# EAGLE design TTGO_shield_revH (EAGLE 9.1.2)
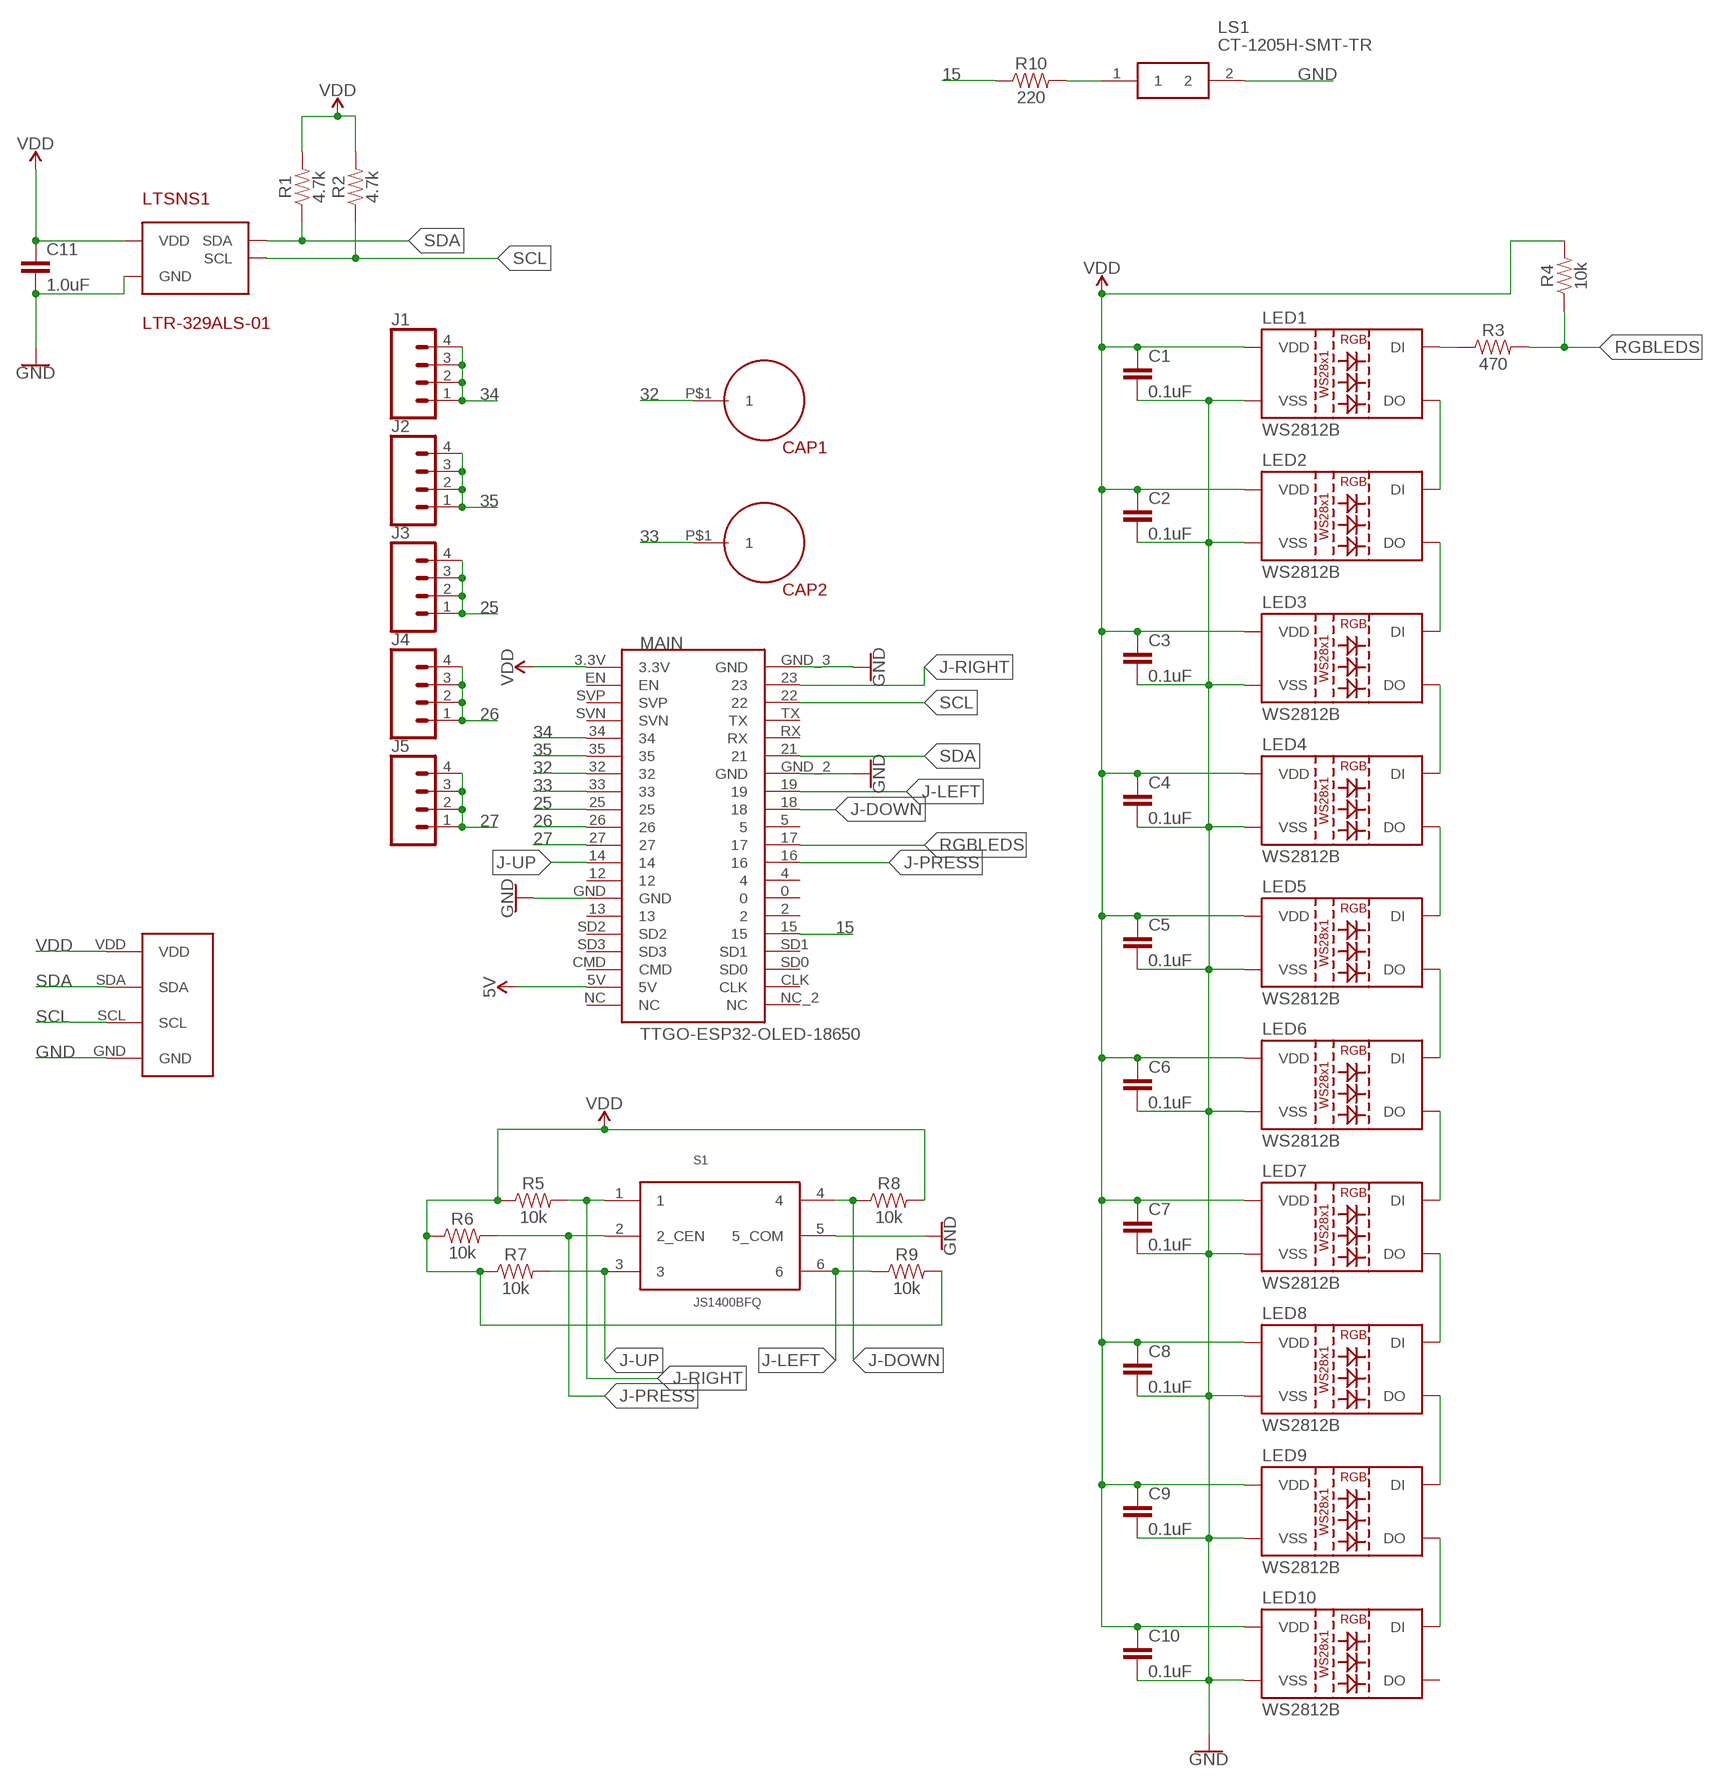
[diagram p0: schematic, sheet 1]

## Parts
C1  0.1uF  0.1UF-0603-25V-5%  [0603]
C2  0.1uF  0.1UF-0603-25V-5%  [0603]
C3  0.1uF  0.1UF-0603-25V-5%  [0603]
C4  0.1uF  0.1UF-0603-25V-5%  [0603]
C5  0.1uF  0.1UF-0603-25V-5%  [0603]
C6  0.1uF  0.1UF-0603-25V-5%  [0603]
C7  0.1uF  0.1UF-0603-25V-5%  [0603]
C8  0.1uF  0.1UF-0603-25V-5%  [0603]
C9  0.1uF  0.1UF-0603-25V-5%  [0603]
C10  0.1uF  0.1UF-0603-25V-5%  [0603]
C11  1.0uF  1.0UF-0805-25V-10%  [0805]
CAP1  CAPSENSE_BUTTON  [CAPSENSE_BUTTON]
CAP2  CAPSENSE_BUTTON  [CAPSENSE_BUTTON]
J1  CONN_04LONGPADS  [1X04_LONGPADS]
J2  CONN_04LONGPADS  [1X04_LONGPADS]
J3  CONN_04LONGPADS  [1X04_LONGPADS]
J4  CONN_04LONGPADS  [1X04_LONGPADS]
J5  CONN_04LONGPADS  [1X04_LONGPADS]
LED1  WS2812B  [WS2812B]
LED2  WS2812B  [WS2812B]
LED3  WS2812B  [WS2812B]
LED4  WS2812B  [WS2812B]
LED5  WS2812B  [WS2812B]
LED6  WS2812B  [WS2812B]
LED7  WS2812B  [WS2812B]
LED8  WS2812B  [WS2812B]
LED9  WS2812B  [WS2812B]
LED10  WS2812B  [WS2812B]
LS1  CT-1205H-SMT-TR  [CT1205HSMTTR]
LTSNS1  LTR-329ALS-01  [CHIPLED-4]
MAIN  TTGO-ESP32-OLED-18650  [TTGO-ESP32-OLED-18650]
R1  4.7k  4.7KOHM-0603-1/10W-1%  [0603]
R2  4.7k  4.7KOHM-0603-1/10W-1%  [0603]
R3  470  470OHM-0603-1/10W-1%  [0603]
R4  10k  10KOHM-0603-1/10W-1%  [0603]
R5  10k  10KOHM-0603-1/10W-1%  [0603]
R6  10k  10KOHM-0603-1/10W-1%  [0603]
R7  10k  10KOHM-0603-1/10W-1%  [0603]
R8  10k  10KOHM-0603-1/10W-1%  [0603]
R9  10k  10KOHM-0603-1/10W-1%  [0603]
R10  220  470OHM-0603-1/10W-1%  [0603]
S1  JS1400BFQ  [JS1400BFQ]
U$2  I2C-FEMALE-HEADER  [I2C-FEMALE-HEADER]

## Nets
5V: MAIN.5V
15: MAIN.15 R10.1
25: J3.1 J3.2 J3.3 J3.4 MAIN.25
26: J4.1 J4.2 J4.3 J4.4 MAIN.26
27: J5.1 J5.2 J5.3 J5.4 MAIN.27
32: CAP1.P$1 MAIN.32
33: CAP2.P$1 MAIN.33
34: J1.1 J1.2 J1.3 J1.4 MAIN.34
35: J2.1 J2.2 J2.3 J2.4 MAIN.35
GND [Rail]: C1.2 C2.2 C3.2 C4.2 C5.2 C6.2 C7.2 C8.2 C9.2 C10.2 C11.2 LED1.3(VSS) LED2.3(VSS) LED3.3(VSS) LED4.3(VSS) LED5.3(VSS) LED6.3(VSS) LED7.3(VSS) LED8.3(VSS) LED9.3(VSS) LED10.3(VSS) LS1.2 LTSNS1.2(GND) MAIN.GND MAIN.GND_2(GND) MAIN.GND_3(GND) S1.5(5_COM) U$2.GND
J-DOWN: MAIN.18 R8.1 S1.4
J-LEFT: MAIN.19 R9.1 S1.6
J-PRESS: MAIN.16 R6.2 S1.2(2_CEN)
J-RIGHT: MAIN.23 R5.2 S1.1
J-UP: MAIN.14 R7.2 S1.3
N$1: LED5.2(DO) LED6.4(DI)
N$2: LED6.2(DO) LED7.4(DI)
N$3: LED7.2(DO) LED8.4(DI)
N$4: LED8.2(DO) LED9.4(DI)
N$5: LED4.2(DO) LED5.4(DI)
N$6: LED9.2(DO) LED10.4(DI)
N$7: LS1.1 R10.2
N$9: LED1.2(DO) LED2.4(DI)
N$10: LED2.2(DO) LED3.4(DI)
N$11: LED3.2(DO) LED4.4(DI)
N$12: LED1.4(DI) R3.1
RGBLEDS: MAIN.17 R3.2 R4.1
SCL: LTSNS1.4(SCL) MAIN.22 R2.1 U$2.SCL
SDA: LTSNS1.3(SDA) MAIN.21 R1.1 U$2.SDA
VDD [Rail]: C1.1 C2.1 C3.1 C4.1 C5.1 C6.1 C7.1 C8.1 C9.1 C10.1 C11.1 LED1.1(VDD) LED2.1(VDD) LED3.1(VDD) LED4.1(VDD) LED5.1(VDD) LED6.1(VDD) LED7.1(VDD) LED8.1(VDD) LED9.1(VDD) LED10.1(VDD) LTSNS1.1(VDD) MAIN.3.3V R1.2 R2.2 R4.2 R5.1 R6.1 R7.1 R8.2 R9.2 U$2.VDD
Unconnected: LED10.2(DO) MAIN.0 MAIN.2 MAIN.4 MAIN.5 MAIN.12 MAIN.13 MAIN.CLK MAIN.CMD MAIN.EN MAIN.NC MAIN.NC_2(NC) MAIN.RX MAIN.SD0 MAIN.SD1 MAIN.SD2 MAIN.SD3 MAIN.SVN MAIN.SVP MAIN.TX

## Library data of the parts
C1-C10 = SparkFun-Capacitors:0.1UF: 0.1µF ceramic capacitors A capacitor is a passive two-terminal electrical component used to store electrical energy temporarily in an electric field.; PROD_ID: CAP-08604
C11 = SparkFun-Capacitors:1.0UF: 1µF ceramic capacitors A capacitor is a passive two-terminal electrical component used to store electrical energy temporarily in an electric field.; PROD_ID: CAP-08064
CAP1 CAP2 = BadgeParts:CAPSENSE_BUTTON: Simple pad for capsense buttons
J1-J5 = SparkFun-Connectors:CONN_04: Multi connection point. Often used as Generic Header-pin footprint for 0.1 inch spaced/style header connections On any of the 0.1 inch spaced packages, you can populate with these: Break Away Headers - Straight <https://www.sparkfun.com/products/116> (PRT-00116) Break Away Male Headers - Right Angle <https://www.sparkfun.com/products/553> (PRT-00553) Female Headers <https://www.sparkfun.com/products/115> (PRT-00115) Break Away Headers - Machine Pin <https://www.sparkfun.com/products/117> (PRT-00117) Break Away Female Headers - Swiss Machine Pin <https://www.sparkfun.com/products/743> (PRT-00743) For SCREWTERMINALS and SPRING TERMINALS visit here: Screw Terimnals on SparkFun.com <https://www.sparkfun.com/search/results?term=Screw+Terminals> (5mm/3.5mm/2.54mm spacing) This device is also useful as a general connection point to wire up your design to another part of your project. Our various solder wires solder well into these plated through hole pads. Hook-Up Wire - Assortment (Stranded, 22 AWG) <https://www.sparkfun.com/products/11375> (PRT-11375) Hook-Up Wire - Assortment (Solid Core, 22 AWG) <https://www.sparkfun.com/products/11367> (PRT-11367) View the entire wire category on our website here <https://www.sparkfun.com/categories/141> Special notes: Molex polarized connector foot print use with SKU : PRT-08231 with associated crimp pins and housings. 1MM SMD Version SKU: PRT-10208; PROD_ID: CONN-09696
LED1-LED10 = SparkFun-LED:WS2812B: WS2812B SMD addressable RGB LED 5x5mm SMD LED with built-in controller IC. Color: Red/Green/Blue mC Rating: RGB: 390, 660, 180 mcd Forward Voltage: RGB: 2.0, 3.0, 3.0 V Packages:WS2812B SparkFun Products: Blynk Board - ESP8266 <https://www.sparkfun.com/products/13794>; PROD_ID: DIO-12503
LS1 = BadgeParts:CT-1205H-SMT-TR: Speakers & Transducers Buzzers Source: Datasheet <http://www.cui.com/product/resource/ct-1205h-smt.pdf>; ARROW_PART_NUMBER: CT-1205H-SMT-TR; ARROW_PRICE/STOCK: https://www.arrow.com/en/products/ct-1205h-smt-tr/cui-inc; DESCRIPTION: Speakers & Transducers Buzzers; HEIGHT: 10mm; MANUFACTURER_NAME: CUI; MANUFACTURER_PART_NUMBER: CT-1205H-SMT-TR
LTSNS1 = NickParts:LTR-329ALS-01
MAIN = BadgeParts:TTGO-ESP32-OLED-18650: Input-only pins: IO34, IO35, Sensor_VP, Sensor_VN, are labeled in docs as GPI (note the lack of O), which may mean they're input-only pins. Pins 4 and 5 go to the OLED SDA/SCL IO32 IO33 are connected to the crystal. Docs say you can't use these 2x pins as GPIO unless you desolder some stuff on the module. There's 5 "strapping" pins, which effect how the ESP-32 boots depending on if they're pulled high or low. So it's possible that something you've hooked upto these pins may effect how it boots. These pins are: 0 2 5 12 15
R1 R2 = SparkFun-Resistors:4.7KOHM: 4.7kΩ resistor A resistor is a passive two-terminal electrical component that implements electrical resistance as a circuit element. Resistors act to reduce current flow, and, at the same time, act to lower voltage levels within circuits. - Wikipedia; PROD_ID: RES-07857
R3 = SparkFun-Resistors:470OHM: 470Ω resistor A resistor is a passive two-terminal electrical component that implements electrical resistance as a circuit element. Resistors act to reduce current flow, and, at the same time, act to lower voltage levels within circuits. - Wikipedia; PROD_ID: RES-07869
R4-R9 = SparkFun-Resistors:10KOHM: 10kΩ resistor A resistor is a passive two-terminal electrical component that implements electrical resistance as a circuit element. Resistors act to reduce current flow, and, at the same time, act to lower voltage levels within circuits. - Wikipedia; PROD_ID: RES-00824
R10 = SparkFun-Resistors:470OHM: 470Ω resistor A resistor is a passive two-terminal electrical component that implements electrical resistance as a circuit element. Resistors act to reduce current flow, and, at the same time, act to lower voltage levels within circuits. - Wikipedia; PROD_ID: RES-07869; VALUE: 470
S1 = BadgeParts:JS1400BFQ: 5-way SMD tactile switch
U$2 = BadgeParts:I2C-FEMALE-HEADER

## Net classes
0 Default: width 0.381 mm, clearance 0.254 mm
1 Rail: width 0.635 mm, clearance 0.254 mm

## Board
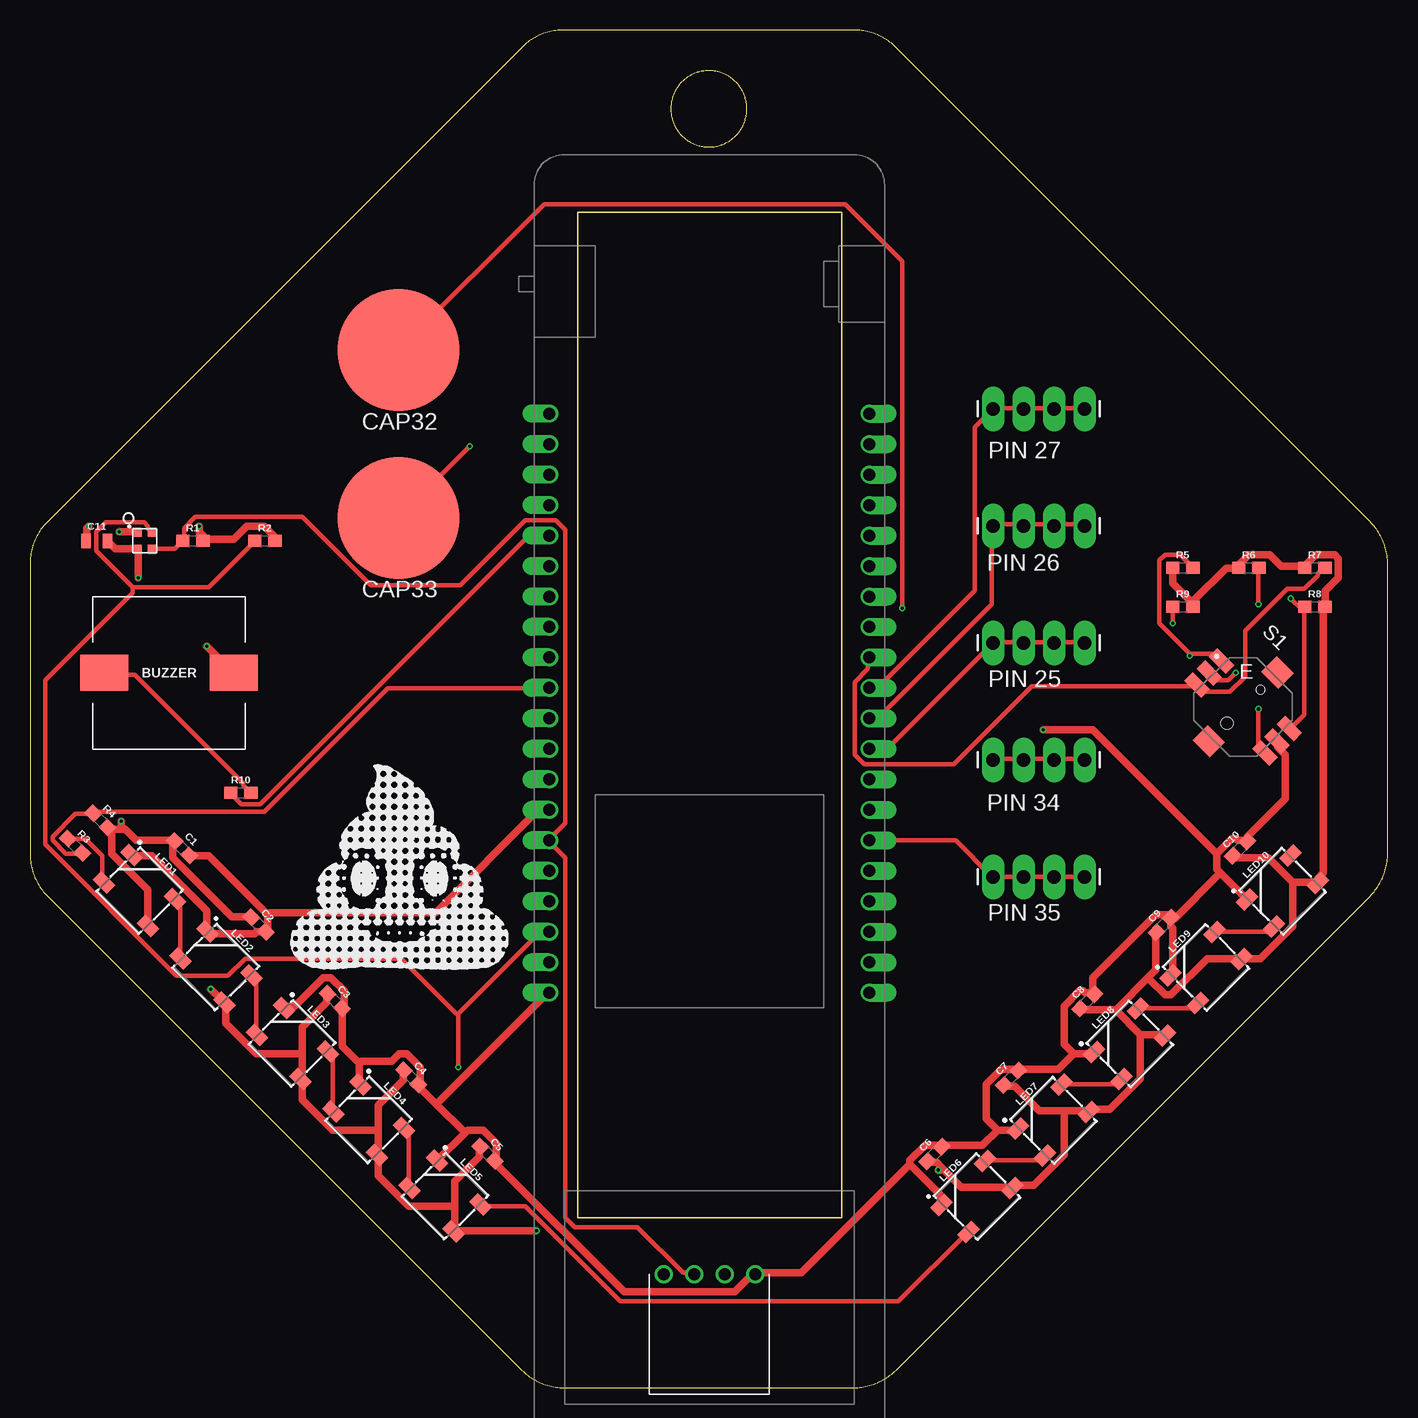
[diagram p1: board, top side]
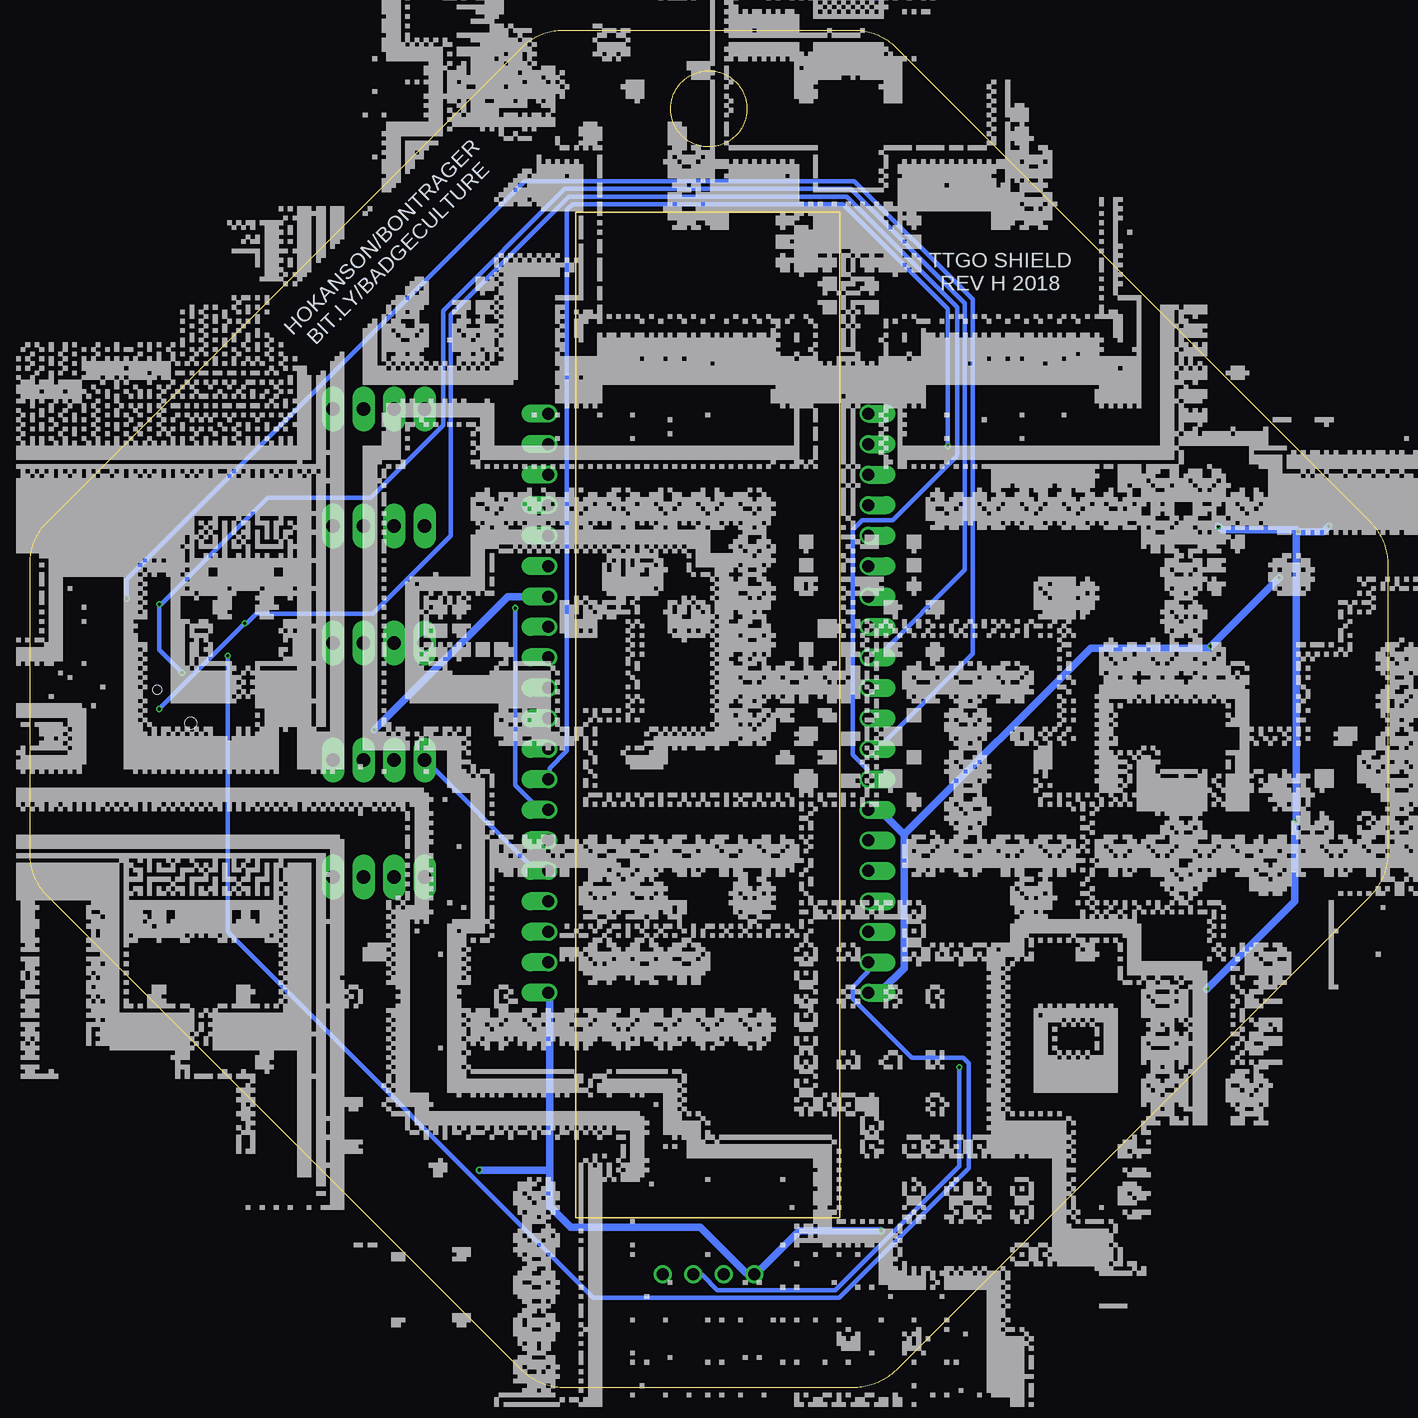
[diagram p2: board, bottom side, seen from below]

Size 113.14 x 113.14 mm. Coordinates in mm from the lower left corner, seen from the top.
Outline: 44.5,113.14 44.33,113.13 44.16,113.13 43.99,113.11 43.82,113.09 43.65,113.06 43.48,113.03 43.31,112.99 43.15,112.95 42.98,112.9 42.82,112.85 42.66,112.79 42.51,112.72 42.35,112.65 42.2,112.58 42.05,112.5 41.9,112.41 41.75,112.32 41.61,112.22 41.48,112.12 41.34,112.02 41.21,111.91 41.08,111.79 40.96,111.67 1.46,72.18 1.35,72.05 1.23,71.93 1.12,71.8 1.02,71.66 0.91,71.52 0.82,71.38 0.73,71.24 0.64,71.09 0.56,70.94 0.48,70.79 0.41,70.63 0.35,70.47 0.29,70.31 0.23,70.15 0.19,69.99 0.14,69.82 0.1,69.66 0.07,69.49 0.05,69.32 0.03,69.15 0.01,68.98 0,68.81 0,68.64 0,44.5 0,44.33 0.01,44.16 0.03,43.99 0.05,43.82 0.07,43.65 0.1,43.48 0.14,43.31 0.19,43.15 0.23,42.98 0.29,42.82 0.35,42.66 0.41,42.51 0.48,42.35 0.56,42.2 0.64,42.05 0.73,41.9 0.82,41.76 0.91,41.61 1.02,41.48 1.12,41.34 1.23,41.21 1.35,41.08 1.46,40.96 40.96,1.46 41.08,1.35 41.21,1.23 41.34,1.12 41.48,1.02 41.61,0.92 41.75,0.82 41.9,0.73 42.05,0.64 42.2,0.56 42.35,0.48 42.51,0.41 42.66,0.35 42.82,0.29 42.98,0.23 43.15,0.19 43.31,0.14 43.48,0.1 43.65,0.07 43.82,0.05 43.99,0.03 44.16,0.01 44.33,0 44.5,0 68.64,0 68.81,0 68.98,0.01 69.15,0.03 69.32,0.05 69.49,0.07 69.66,0.1 69.82,0.14 69.99,0.19 70.15,0.23 70.31,0.29 70.47,0.35 70.63,0.41 70.79,0.48 70.94,0.56 71.09,0.64 71.24,0.73 71.38,0.82 71.52,0.92 71.66,1.02 71.79,1.12 71.93,1.23 72.05,1.35 72.17,1.46 111.67,40.96 111.79,41.08 111.91,41.21 112.02,41.34 112.12,41.48 112.22,41.61 112.32,41.76 112.41,41.9 112.5,42.05 112.58,42.2 112.65,42.35 112.72,42.51 112.79,42.66 112.85,42.82 112.9,42.98 112.95,43.15 112.99,43.31 113.03,43.48 113.06,43.65 113.09,43.82 113.11,43.99 113.13,44.16 113.13,44.33 113.14,44.5 113.14,68.64 113.13,68.81 113.13,68.98 113.11,69.15 113.09,69.32 113.06,69.49 113.03,69.66 112.99,69.82 112.95,69.99 112.9,70.15 112.85,70.31 112.79,70.47 112.72,70.63 112.65,70.79 112.58,70.94 112.5,71.09 112.41,71.24 112.32,71.38 112.22,71.52 112.12,71.66 112.02,71.8 111.91,71.93 111.79,72.05 111.67,72.18 72.17,111.67 72.05,111.79 71.93,111.91 71.79,112.02 71.66,112.12 71.52,112.22 71.38,112.32 71.24,112.41 71.09,112.5 70.94,112.58 70.79,112.65 70.63,112.72 70.47,112.79 70.31,112.85 70.15,112.9 69.99,112.95 69.82,112.99 69.66,113.03 69.49,113.06 69.32,113.09 69.15,113.11 68.98,113.13 68.81,113.13 68.64,113.14 44.5,113.14
Outline: 59.74,106.57 59.74,106.68 59.74,106.79 59.73,106.9 59.71,107.01 59.7,107.12 59.67,107.23 59.65,107.33 59.62,107.44 59.59,107.54 59.55,107.65 59.51,107.75 59.47,107.85 59.43,107.95 59.38,108.05 59.32,108.15 59.27,108.24 59.21,108.34 59.14,108.43 59.08,108.51 59.01,108.6 58.94,108.68 58.86,108.76 58.78,108.84 58.7,108.92 58.62,108.99 58.54,109.06 58.45,109.13 58.36,109.19 58.27,109.25 58.17,109.31 58.08,109.36 57.98,109.41 57.88,109.46 57.78,109.5 57.67,109.54 57.57,109.58 57.47,109.61 57.36,109.64 57.25,109.67 57.14,109.69 57.03,109.71 56.93,109.72 56.82,109.73 56.71,109.74 56.6,109.74 56.49,109.74 56.38,109.74 56.27,109.73 56.16,109.72 56.05,109.7 55.94,109.68 55.83,109.66 55.72,109.63 55.62,109.6 55.51,109.56 55.41,109.53 55.31,109.48 55.21,109.44 55.11,109.39 55.01,109.34 54.92,109.28 54.82,109.22 54.73,109.16 54.64,109.09 54.56,109.03 54.47,108.95 54.39,108.88 54.31,108.8 54.24,108.72 54.16,108.64 54.09,108.56 54.03,108.47 53.96,108.38 53.9,108.29 53.84,108.2 53.79,108.1 53.74,108 53.69,107.9 53.64,107.8 53.6,107.7 53.56,107.6 53.53,107.49 53.5,107.39 53.47,107.28 53.45,107.17 53.43,107.06 53.42,106.95 53.41,106.84 53.4,106.73 53.39,106.62 53.39,106.51 53.4,106.4 53.41,106.29 53.42,106.18 53.43,106.07 53.45,105.97 53.47,105.86 53.5,105.75 53.53,105.65 53.56,105.54 53.6,105.44 53.64,105.33 53.69,105.23 53.74,105.13 53.79,105.04 53.84,104.94 53.9,104.85 53.96,104.76 54.03,104.67 54.09,104.58 54.16,104.5 54.24,104.41 54.31,104.33 54.39,104.26 54.47,104.18 54.56,104.11 54.64,104.04 54.73,103.98 54.82,103.92 54.92,103.86 55.01,103.8 55.11,103.75 55.21,103.7 55.31,103.65 55.41,103.61 55.51,103.57 55.62,103.54 55.72,103.51 55.83,103.48 55.94,103.46 56.05,103.44 56.16,103.42 56.27,103.41 56.38,103.4 56.49,103.39 56.6,103.39 56.71,103.4 56.82,103.4 56.93,103.41 57.03,103.43 57.14,103.45 57.25,103.47 57.36,103.49 57.47,103.52 57.57,103.56 57.67,103.59 57.78,103.63 57.88,103.68 57.98,103.72 58.08,103.77 58.17,103.83 58.27,103.89 58.36,103.95 58.45,104.01 58.54,104.08 58.62,104.15 58.7,104.22 58.78,104.29 58.86,104.37 58.94,104.45 59.01,104.54 59.08,104.62 59.14,104.71 59.21,104.8 59.27,104.89 59.32,104.99 59.38,105.09 59.43,105.18 59.47,105.28 59.51,105.39 59.55,105.49 59.59,105.59 59.62,105.7 59.65,105.8 59.67,105.91 59.7,106.02 59.71,106.13 59.73,106.24 59.74,106.35 59.74,106.46 59.74,106.57
Copper layers (1*16): Top 0.035559375mm / dielectric 1.6mm / Bottom 0.035559375mm
Design rules "oshpark-2layer": minimum track width 6mil, minimum drill 10mil, track to track 6mil, track to pad 6mil, pad to pad 6mil, via to via 6mil, smd to smd 6mil, copper to edge 15mil, drill to drill 6mil, minimum pad ring 5mil, minimum via ring 5mil, stop-mask expansion 2.5mil, vias tented up to drill 0mil, thermal gap 10mil

### Footprints (pad centres in the part's own frame; a part is rotated, then mirrored left to right if it is on the bottom)
0603 = smd 1.1 x 1: 1 -0.85,0; 2 0.85,0
0805 = smd 0.8 x 1.2: 1 -0.9,0; 2 0.9,0
CAPSENSE_BUTTON = smd 10.16 x 10.16: P$1 0,0
1X04_LONGPADS = drill 1.118 pad 1.88 long: 1 0,0; 2 2.54,0; 3 5.08,0; 4 7.62,0
WS2812B = smd 1.651 x 1: 1 2.577,-1.6; 2 2.577,1.6; 3 -2.577,1.6; 4 -2.577,-1.6
CT1205HSMTTR = smd 4 x 3: 1 -5.4,0; 2 5.4,0
CHIPLED-4 = smd 0.7 x 0.75: 1 -0.6,0.7; 2 -0.6,-0.7; 3 0.6,-0.7; 4 0.6,0.7
TTGO-ESP32-OLED-18650 = drill 1 offset: 0 26.67,16.51; 2 26.67,13.97; 3.3V 0,49.53; 4 26.67,19.05; 5 26.67,26.67; 5V 0,3.81; 12 0,19.05; 13 0,13.97; 14 0,21.59; 15 26.67,11.43; 16 26.67,21.59; 17 26.67,24.13; 18 26.67,29.21; 19 26.67,31.75; 21 26.67,36.83; 22 26.67,44.45; 23 26.67,46.99; 25 0,29.21; 26 0,26.67; 27 0,24.13; 32 0,34.29; 33 0,31.75; 34 0,39.37; 35 0,36.83; CLK 26.67,3.81; CMD 0,6.35; EN 0,46.99; GND 0,16.51; GND_2 26.67,34.29; GND_3 26.67,49.53; NC 0,1.27; NC_2 26.67,1.27; RX 26.67,39.37; SD0 26.67,6.35; SD1 26.67,8.89; SD2 0,11.43; SD3 0,8.89; SVN 0,41.91; SVP 0,44.45; TX 26.67,41.91
JS1400BFQ = smd 2 x 1: 1 -4,1.43; 2 -4,0; 3 -4,-1.43; 4 4,1.43; 5 4,0; 6 4,-1.43 | smd 2 x 1.8: P$1 0,4.05; P$2 0,-4.05 | hole 0.991: 0,-1.905 | hole 0.711: 0,2.032
I2C-FEMALE-HEADER = drill 1: GND 3.81,0; SCL 1.27,0; SDA -1.27,0; VDD -3.81,0

### Placement (x,y rotation side)
C1  12.67,44.95 315 top
C2  19.03,38.59 315 top
C3  25.4,32.23 315 top
C4  31.76,25.86 315 top
C5  38.12,19.5 315 top
C6  75.38,19.46 45 top
C7  81.74,25.83 45 top
C8  88.1,32.19 45 top
C9  94.47,38.55 45 top
C10  100.83,44.92 45 top
C11  5.57,70.57 0 top
CAP1  30.71,86.46 0 top
CAP2  30.71,72.46 0 top
J1  80.26,52.32 0 top
J2  87.88,42.57 180 top
J3  87.88,62.07 180 top
J4  87.88,71.82 180 top
J5  87.88,81.57 180 top
LED1  9.13,41.42 315 top
LED2  15.5,35.05 315 top
LED3  21.86,28.69 315 top
LED4  28.23,22.33 315 top
LED5  34.59,15.96 315 top
LED6  78.91,15.93 45 top
LED7  85.28,22.29 45 top
LED8  91.64,28.65 45 top
LED9  98,35.02 45 top
LED10  104.37,41.38 45 top
LS1  11.57,59.57 0 top
LTSNS1  9.57,70.57 0 top
MAIN  69.94,82.44 180 top
R1  13.57,70.57 0 top
R2  19.57,70.57 0 top
R3  3.74,45.15 315 top
R4  5.86,47.28 315 top
R5  96.07,68.32 0 top
R6  101.57,68.32 0 top
R7  107.07,68.32 0 top
R8  107.07,65.07 0 top
R9  96.07,65.07 0 top
R10  17.57,49.57 0 top
S1  101.1,56.73 315 top
U$2  56.61,9.46 0 top

### Tracks (layer width: path | path; a pad name or v marks a point on that pad's centre or on a via)
15
  Top 0.381: R10.1 16.81,49.41 17.6,48.62 19.19,48.62 41.57,71 43.16,71 MAIN.15
25
  Top 0.381: J3.1 87.77,62.11 85.39,62.11 J3.2 85.23,62.11 82.85,62.11 J3.3 82.69,62.11 80.31,62.11 J3.4 80.15,61.95 71.58,53.38 69.99,53.38 MAIN.25
26
  Top 0.381: J4.1 87.77,71.95 85.39,71.95 J4.2 85.23,71.95 82.85,71.95 J4.3 82.69,71.95 80.31,71.95 J4.4 80.15,71.79 80.15,65.29 70.78,55.92 69.99,55.92 MAIN.26
27
  Top 0.381: J5.1 87.77,81.64 85.39,81.64 J5.2 85.23,81.64 82.85,81.64 J5.3 82.69,81.64 80.31,81.64 J5.4 80.15,81.48 78.72,80.05 78.72,66.4 70.78,58.46 69.99,58.46 MAIN.27
32  (via drill 0.25)
  Top 0.381: v72.69,64.97 72.69,93.86 67.93,98.62 42.84,98.62 30.78,86.56 CAP1.P$1
  Bottom 0.381: v72.69,64.97 72.69,50.2 70.78,48.3 69.99,48.3 MAIN.32
33  (via drill 0.25)
  Top 0.381: v36.65,78.46 30.78,72.59 CAP2.P$1
  Bottom 0.381: v36.65,78.46 36.65,89.89 45.38,98.62 67.93,98.62 68.4,98.15 68.4,53.06 69.83,51.63 69.83,50.84 MAIN.33
34
  Top 0.381: J1.4 87.77,52.43 85.39,52.43 J1.3 85.23,52.43 82.85,52.43 J1.2 82.69,52.43 80.31,52.43 J1.1
  Bottom 0.381: MAIN.34 69.99,43.22 71.1,43.22 80.15,52.27 J1.1
35
  Top 0.381: J2.1 87.77,42.58 85.39,42.58 J2.2 85.23,42.58 82.85,42.58 J2.3 82.69,42.58 80.31,42.58 J2.4 80.15,42.58 77.13,45.6 69.99,45.6 MAIN.35
GND  (via drill 0.25)
  Top 0.635: C11.2 6.49,70.52 7.12,69.89 8.87,69.89 LTSNS1.2 9.03,69.57 v9.03,67.51 | v14.74,61.79 LS1.2 | 19.82,39.41 14.9,44.33 13.32,44.33 C1.2 | 19.82,39.41 19.82,38.14 C2.2 19.51,37.98 18.87,37.98 18.71,37.82 15.06,37.82 14.9,37.98 LED2.3 14.74,38.3 14.74,39.73 10.14,44.33 8.55,44.33 LED1.3 | 27.44,27.03 26.02,28.46 26.02,31.47 C3.2 26.17,31.79 26.17,33.06 25.06,34.17 24.43,34.17 22.05,31.79 21.25,31.79 LED3.3 | 27.44,27.03 27.44,25.28 LED4.3 | 36.25,21.23 33.95,18.93 LED5.3 | 36.25,21.23 36.49,21.47 37.76,21.47 38.87,20.36 38.87,18.93 C5.2 38.87,18.61 49.51,7.98 58.72,7.98 60.15,9.41 U$2.GND 60.46,9.56 64.27,9.56 73.16,18.45 73.32,18.61 | 33.87,23.61 36.18,21.31 36.25,21.23 | 33.87,23.61 32.37,25.12 C4.2 32.52,25.44 32.52,26.71 31.41,27.82 30.78,27.82 30.14,27.19 27.6,27.19 27.44,27.03 | MAIN.GND_3 43.16,32.9 33.95,23.69 33.87,23.61 | 19.82,39.41 19.98,39.57 33.79,39.57 42.37,48.14 43.16,48.14 MAIN.GND_2 | 86.97,27.82 85.71,26.55 82.37,26.55 C7.2 82.05,26.55 80.94,26.55 79.67,25.28 79.67,22.42 80.47,21.63 80.62,21.47 | 86.97,27.82 88.56,27.82 LED8.3 | 86.97,27.82 86.82,27.98 86.18,28.61 86.18,31.79 87.45,33.06 87.77,33.06 87.93,32.9 88.56,32.9 C8.2 88.56,33.22 88.56,34.17 93.8,39.41 94.91,39.41 C9.2 | 80.62,21.47 79.36,20.2 76.02,20.2 C6.2 75.7,20.2 74.59,20.2 73.32,18.93 73.32,18.61 | 80.62,21.47 82.21,21.47 LED7.3 | 73.32,18.61 75.86,16.07 75.86,15.28 LED6.3 | C9.2 95.07,39.09 95.07,38.46 95.23,38.3 95.23,34.49 95.07,34.33 LED9.3 | 98.88,44.49 100.15,45.76 100.47,45.76 100.63,45.6 101.42,45.6 C10.2 101.42,45.92 104.6,49.09 104.6,52.74 103.96,53.38 103.96,53.86 S1.5
  Top 0.635: 98.88,44.49 98.88,43.22 99.2,42.9 | 99.2,42.9 101.26,40.84 LED10.3 | v84.43,54.81 88.56,54.81 98.72,44.65 98.88,44.49 | C9.2 95.39,39.09 99.04,42.74 99.2,42.9
  Bottom 0.635: v9.03,67.51 v14.74,61.79 14.9,61.63 24.75,61.63 40.14,46.24 40.3,46.08 | 40.3,46.08 42.37,48.14 43.16,48.14 MAIN.GND_2 | 40.3,46.08 40.3,34.96 42.21,33.06 43.16,33.06 MAIN.GND_3 | v84.43,54.81 73.32,65.92 69.99,65.92 MAIN.GND
J-DOWN  (via drill 0.25)
  Top 0.381: S1.4 105.07,54.97 106.18,56.08 106.18,64.97 R8.1 106.03,64.81 v105.07,65.76
  Bottom 0.381: v105.07,65.76 105.07,67.35 71.89,100.53 44.43,100.53 34.59,90.69 34.59,61.16 42.37,53.38 43.16,53.38 MAIN.18
J-LEFT  (via drill 0.25)
  Top 0.381: v95.23,63.7 95.23,64.97 R9.1 | v102.37,56.55 102.37,53.38 102.85,52.9 S1.6
  Bottom 0.381: v102.37,56.55 v95.23,63.7 95.07,63.7 94.28,64.49 84.59,64.49 78.08,71 78.08,89.42 68.24,99.26 45.06,99.26 35.86,90.05 35.86,77.67 41.25,72.27 43.79,72.27 44.59,71.48 44.59,52.74 43.32,51.47 43.32,50.84 MAIN.19
J-PRESS  (via drill 0.25)
  Top 0.381: v102.37,65.29 102.37,68.3 R6.2 | v100.47,59.57 99.83,58.94 98.88,58.94 98.4,59.41 S1.2
  Bottom 0.381: v100.47,59.57 102.37,61.48 v102.37,65.29 102.22,65.29 93.32,74.18 84.75,74.18 78.72,80.21 78.72,89.73 68.56,99.89 44.75,99.89 35.22,90.37 35.22,68.14 42.37,61 43.16,61 MAIN.16
J-RIGHT  (via drill 0.25)
  Top 0.381: 96.66,61.16 94.12,63.7 94.12,68.94 94.6,69.41 95.86,69.41 96.82,68.46 R5.2 | 96.66,61.16 98.72,61.16 99.2,60.68 S1.1 | v96.66,61 96.66,61.16
  Bottom 0.381: v96.66,61 96.66,37.98 66.18,7.5 45.7,7.5 34.9,18.3 34.9,27.03 35.38,27.5 39.67,27.5 44.59,32.42 44.59,33.38 43.32,34.65 43.32,35.44 MAIN.23
J-UP
  Top 0.381: R7.2 107.77,68.3 107.3,67.83 107.3,67.67 106.18,66.56 104.75,66.56 101.26,63.06 101.26,59.25 99.99,57.98 97.77,57.98 97.29,58.46 S1.3 97.14,58.46 83.48,58.46 76.97,51.95 69.51,51.95 68.72,52.74 68.72,58.78 69.83,59.89 69.83,60.84 MAIN.14
N$1
  Top 0.381: LED5.2 37.6,15.12 41.25,15.12 49.19,7.18 72.37,7.18 78.08,12.9 LED6.4
N$2
  Top 0.381: LED6.2 79.67,18.93 84.12,18.93 84.43,19.25 LED7.4
N$3
  Top 0.381: LED7.2 86.02,25.28 90.63,25.28 90.94,25.6 LED8.4
N$4
  Top 0.381: LED8.2 92.37,31.63 96.98,31.63 97.29,31.95 LED9.4
N$5
  Top 0.381: LED5.4 31.57,16.71 31.57,21.31 31.25,21.63 LED4.2
N$6
  Top 0.381: LED9.2 98.72,37.98 103.33,37.98 103.64,38.3 LED10.4
N$7
  Top 0.381: R10.2 18.4,49.57 17.76,50.2 17.76,50.36 8.71,59.41 6.17,59.41 LS1.1
N$9
  Top 0.381: LED2.4 12.52,35.76 12.52,40.36 12.2,40.68 LED1.2
N$10
  Top 0.381: LED3.4 18.87,29.41 18.87,34.01 18.55,34.33 LED2.2
N$11
  Top 0.381: LED4.4 25.22,23.06 25.22,27.66 24.9,27.98 LED3.2
N$12
  Top 0.381: R3.1 3.15,45.76 4.58,45.76 6.01,44.33 6.01,42.43 6.17,42.27 LED1.4
RGBLEDS
  Top 0.381: R3.2 4.27,44.49 3,44.49 1.89,45.6 1.89,45.92 3.79,47.82 5.22,47.82 R4.1 5.38,47.98 19.51,47.98 29.82,58.3 43.16,58.3 MAIN.17
SCL  (via drill 0.25)
  Top 0.381: 8.55,66.71 5.54,69.73 5.54,71.32 6.33,72.11 9.5,72.11 9.82,71.79 9.82,71.64 10.14,71.32 LTSNS1.4 | 8.55,66.71 14.9,66.71 18.71,70.52 R2.1 | 35.7,31.15 v35.7,26.71 | 35.7,31.15 42.53,37.98 43.16,37.98 MAIN.22 | 8.55,66.71 8.55,66.56 8.55,66.24 1.25,58.94 1.25,45.28 12.2,34.33 16.49,34.33 17.92,35.76 30.94,35.76 35.54,31.15 35.7,31.15
  Bottom 0.381: v35.7,26.71 35.7,18.45 46.02,8.14 55.86,8.14 57.13,9.41 57.76,9.41 U$2.SCL
SDA
  Top 0.381: LTSNS1.3 10.3,69.89 12.04,69.89 12.68,70.52 R1.1 12.84,70.68 12.84,71.64 13.79,72.59 22.68,72.59 28.4,66.87 35.86,66.87 41.25,72.27 43.79,72.27 44.59,71.48 44.59,47.03 43.32,45.76 MAIN.21 43.32,45.44 44.59,44.17 44.59,14.17 45.38,13.37 50.62,13.37 54.43,9.56 55.23,9.56 U$2.SDA
VDD  (via drill 0.25)
  Top 0.635: 86.18,23.06 88.09,23.06 LED7.1 88.4,23.22 89.99,23.22 92.53,25.76 92.53,29.25 92.53,29.41 | 86.18,23.06 84.12,23.06 82.05,25.12 81.26,25.12 C7.1 | 76.02,18.3 77.61,16.71 81.74,16.71 LED6.1 82.05,16.87 83.64,16.87 86.18,19.41 86.18,22.9 86.18,23.06 | 76.02,18.3 75.54,18.77 74.91,18.77 C6.1 | 96.82,65.44 95.23,67.03 95.23,68.3 R5.1 | 96.82,65.44 96.82,65.13 R9.2 | 96.82,65.44 96.98,65.6 99.68,68.3 100.63,68.3 R6.1 100.79,68.62 101.58,69.41 103.33,69.41 104.28,68.46 106.18,68.46 R7.1 106.34,68.62 107.14,69.41 108.72,69.41 109.04,69.1 109.04,67.51 107.93,66.4 107.93,65.13 R8.2 107.77,64.81 107.77,42.9 107.3,42.43 LED10.1 107.3,42.11 105.23,42.11 | 105.23,42.11 103.17,44.17 100.31,44.17 C10.1 | 105.23,42.11 105.23,41.95 105.23,38.46 102.53,35.76 101.1,35.76 LED9.1 100.63,35.76 98.09,35.76 95.07,32.74 94.6,32.74 93.32,34.01 93.17,34.17 | 90.47,31.47 87.61,31.47 C8.1 | 92.53,29.41 90.47,31.47 | 92.53,29.41 94.44,29.41 LED8.1 | 93.17,34.17 90.63,31.63 90.47,31.47 | 93.17,34.17 93.8,34.81 93.8,37.82 C9.1 | v7.44,71.32 8.87,71.32 LTSNS1.1 | v4.9,71.79 4.74,71.64 4.74,70.68 C11.1 | R2.2 20.3,70.68 20.3,71 19.51,71.79 18.08,71.79 16.97,70.68 14.43,70.68 R1.2 14.43,71 14.11,71.32 v14.11,71.79 | 7.6,46.55 6.49,46.55 R4.2 6.81,46.39 6.81,44.49 9.82,41.47 9.82,38.62 LED1.1 | 7.6,46.55 7.92,46.55 8.87,45.6 12.04,45.6 C1.1 11.89,45.28 11.89,44.17 16.81,39.25 18.4,39.25 C2.1 | v7.6,47.19 7.6,46.71 7.6,46.55 | 35.38,15.12 35.38,13.06 LED5.1 35.7,13.06 v42.21,13.06 | 35.38,15.12 35.38,17.18 37.44,19.25 37.44,20.04 C5.1 | 29.03,21.47 29.03,19.41 LED4.1 29.03,19.09 29.03,17.66 31.57,15.12 35.22,15.12 35.38,15.12
  Top 0.635: 29.03,21.47 29.03,23.53 31.09,25.6 31.09,26.39 C4.1 | 22.68,27.82 22.68,25.76 LED3.1 22.68,25.44 22.68,24.01 25.22,21.47 28.87,21.47 29.03,21.47 | 22.68,27.82 22.68,30.04 24.75,32.11 24.75,32.74 C3.1 | 22.68,27.82 22.52,27.82 18.87,27.82 16.33,30.36 16.33,31.95 LED2.1 16.01,32.27 v15.06,33.22 | v75.7,18.14 75.86,18.14 76.02,18.3
  Bottom 0.635: v7.44,71.32 5.38,71.32 v4.9,71.79 | v14.11,71.79 13.79,71.48 7.6,71.48 v7.44,71.32 | v7.44,71.32 7.6,71.16 v7.6,47.19 7.76,47.03 7.76,40.52 v15.06,33.22 | 69.83,18.14 69.83,32.9 MAIN.3.3V | 69.83,18.14 69.83,15.12 68.08,13.37 57.29,13.37 53.48,9.56 52.84,9.56 U$2.VDD 52.53,9.56 49.03,13.06 v42.21,13.06 | v75.7,18.14 69.99,18.14 69.83,18.14

### Text on the board
tPlace: CAP32 | PIN 27 | PIN 26 | CAP33 | PIN 25 | PIN 34 | PIN 35
bPlace: HOKANSON/BONTRAGER / BIT.LY/BADGECULTURE | TTGO SHIELD / REV H 2018